# Altium schematic sheet MCU & Power.SchDoc
size A4; SheetNumber: 5; SheetTotal: 5
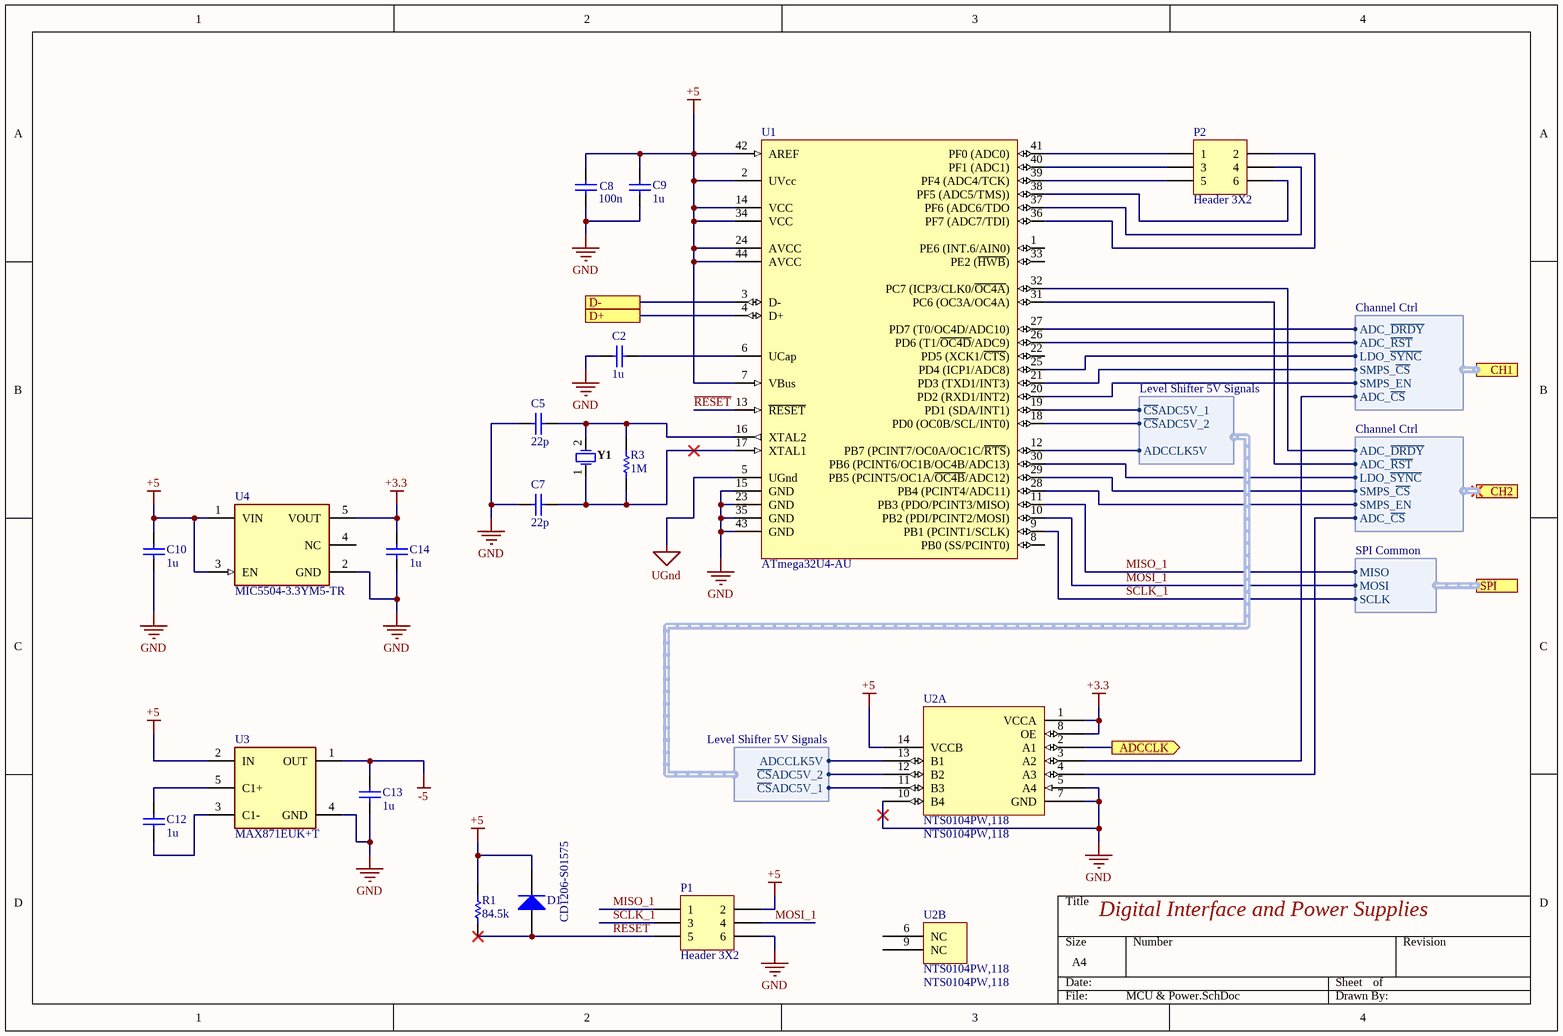
[diagram p0: MCU & Power.SchDoc]

## Parts
C2  1u  [CAPC2013X140X50LL20T25]
C5  22p  [CAPC2013X140X50NL20T25]
C7  22p  [CAPC2013X140X50NL20T25]
C8  100n  [CAPC2013X145X50LL20T25]
C9  1u  [CAPC2013X140X50LL20T25]
C10  1u  [CAPC2013X140X50LL20T25]
C12  1u  [CAPC2013X140X50LL20T25]
C13  1u  [CAPC2013X140X50LL20T25]
C14  1u  [CAPC2013X140X50LL20T25]
D1  CD1206-S01575  [BOUR-CD1206-S01575-2_N]
P1  Header 3X2  [HDR2X3]
P2  Header 3X2  [HDR2X3]
R1  84.5k  [RESC2013X60X35NL10T20]
R3  1M  [RESC2013X70X40NL20T20]
U1  ATmega32U4-AU  [44ML_M]
U2  NTS0104PW,118  [TSOP65P640X110-14N]  (parts A,B of 2)
U3  MAX871EUK+T  [FP-U5-2-MFG]
U4  MIC5504-3.3YM5-TR  [FP-SOT23-5LD-PL-1-MFG]
Y1  FOXSLF/160-20  [FOX-FOXSLF160-20]  (value not drawn)

## Ports
ADCCLK (out), CH1 (harness Channel Ctrl), CH2 (harness Channel Ctrl), D+, D-, SPI (harness SPI Common)

## Harnesses
Level Shifter 5V Signals: ~{CS}ADC5V_1, ~{CS}ADC5V_2, ADCCLK5V
Level Shifter 5V Signals: ADCCLK5V, ~{CS}ADC5V_1, ~{CS}ADC5V_2
Channel Ctrl: ADC_~{CS}, SMPS_EN, SMPS_~{CS}, LDO_~{SYNC}, ADC_~{RST}, ADC_~{DRDY}
SPI Common: MISO, MOSI, SCLK

## Nets
+3.3: C14.2 U2.1(VCCA) U2.8(OE) U4.5(VOUT)
+5: C8.2 C9.2 C10.2 D1.2(K) P1.2 R1.2 U1.2(UVcc) U1.7(VBus) U1.14(VCC) U1.24(AVCC) U1.34(VCC) U1.42(AREF) U1.44(AVCC) U2.14(VCCB) U3.2(IN) U4.1(VIN) U4.3(EN)
-5: C13.2 U3.1(OUT)
GND: C2.2 C5.1 C7.1 C8.1 C9.1 C10.1 C13.1 C14.1 P1.6 U1.15(GND) U1.23(GND) U1.35(GND) U1.43(GND) U2.5(A4) U2.7(GND) U2.10(B4) U3.4(GND) U4.2(GND)
UGnd: U1.5(UGnd)
ADCCLK: U2.2(A1) ; port ADCCLK
D+: U1.4(D+) ; port D+
D-: U1.3(D-) ; port D-
MISO_1: P1.1 U1.11(PB3_(PDO/PCINT3/MISO)) ; port SPI.MISO
MOSI_1: P1.4 U1.10(PB2_(PDI/PCINT2/MOSI)) ; port SPI.MOSI
~{RESET}: D1.1(A) P1.5 R1.1 U1.13(~{RESET})
SCLK_1: P1.3 U1.9(PB1_(PCINT1/SCLK)) ; port SPI.SCLK
NetC2_1: C2.1 U1.6(UCap)
NetC5_2: C5.2 R3.2 U1.16(XTAL2) Y1.2
NetC7_2: C7.2 R3.1 U1.17(XTAL1) Y1.1
NetC12_1: C12.1 U3.3(C1-)
NetC12_2: C12.2 U3.5(C1+)
NetP2_1: P2.1 U1.41(PF0_(ADC0))
NetP2_2: P2.2 U1.36(PF7_(ADC7/TDI))
NetP2_3: P2.3 U1.40(PF1_(ADC1))
NetP2_4: P2.4 U1.37(PF6_(ADC6/TDO)
NetP2_5: P2.5 U1.39(PF4_(ADC4/TCK))
NetP2_6: P2.6 U1.38(PF5_(ADC5/TMS)))
NetU1_12: U1.12(PB7_(PCINT7/OC0A/OC1C/~{RTS})) U2.13(B1) ; harness Level Shifter 5V Signals.ADCCLK5V
NetU1_18: U1.18(PD0_(OC0B/SCL/INT0)) U2.12(B2) ; harness Level Shifter 5V Signals.~{CS}ADC5V_2
NetU1_19: U1.19(PD1_(SDA/INT1)) U2.11(B3) ; harness Level Shifter 5V Signals.~{CS}ADC5V_1
NetU1_20: U1.20(PD2_(RXD1/INT2)) ; port CH1.SMPS_EN
NetU1_21: U1.21(PD3_(TXD1/INT3)) ; port CH1.SMPS_~{CS}
NetU1_25: U1.25(PD4_(ICP1/ADC8)) ; port CH1.LDO_~{SYNC}
NetU1_26: U1.26(PD6_(T1/~{OC4D}/ADC9)) ; port CH1.ADC_~{RST}
NetU1_27: U1.27(PD7_(T0/OC4D/ADC10)) ; port CH1.ADC_~{DRDY}
NetU1_28: U1.28(PB4_(PCINT4/ADC11)) ; port CH2.SMPS_EN
NetU1_29: U1.29(PB5_(PCINT5/OC1A/~{OC4B}/ADC12)) ; port CH2.SMPS_~{CS}
NetU1_30: U1.30(PB6_(PCINT6/OC1B/OC4B/ADC13)) ; port CH2.LDO_~{SYNC}
NetU1_31: U1.31(PC6_(OC3A/OC4A)) ; port CH2.ADC_~{RST}
NetU1_32: U1.32(PC7_(ICP3/CLK0/~{OC4A})) ; port CH2.ADC_~{DRDY}
NetU2_3: U2.3(A2) ; port CH1.ADC_~{CS}
NetU2_4: U2.4(A3) ; port CH2.ADC_~{CS}

Not connected (* = marked no-connect by the designer): U1 1(PE6_(INT.6/AIN0)) 8(PB0_(SS/PCINT0)) 22(PD5_(XCK1/~{CTS})) 33(PE2_(~{HWB})); U2 6(NC) 9(NC); U4 4(NC)

## Notes on the sheet
- Digital Interface and Power Supplies

## Library data of the parts
C2 C9 C10 C12-C14 = CMP-2007-03234-1: Part Number: C0805C105K3RACTU; Manufacturer: Kemet
C5 C7 = CMP-2007-04539-1: Part Number: 08051A220JAT2A; Manufacturer: AVX Interconnect / Elco
C8 = CMP-2007-01136-1: Manufacturer: Kemet; Part Number: C0805C104K3RALTU
D1 = CMP-0583-00001-2: 75 V Small Signal Switching Diode, 150 mA, 2.5 uA, 1026 Molded Package, RoHS, Tape and Reel; Manufacturer: Bourns; Reverse Voltage: 75 V; Average Forward Current: 150 mA; Reverse Current (Max.): 2.5 uA; Capacitance Between Terminals (Max.): 3 pF; Reverse Recovery Time (Max.): 4 nS; Forward Voltage (Max.): 1.00 V; Packing: Tape and Reel; Mounting Technology: Surface Mount; DatasheetVersion: Rev. 06/11; ComponentLink2URL: http://www.bourns.com/data/global/pdfs/CD1206_S01575.pdf; PackageReference: CD1206-S01575-2; RoHS: TRUE; ComponentLink1URL: http://www.bourns.com/; ComponentLink1Description: Manufacturer URL; ComponentLink3Description: Package Specification; ComponentLink3URL: http://www.bourns.com/data/global/pdfs/CD1206_S01575.pdf; ComponentLink2Description: Datasheet; PackageDescription: 2-Pin SMD, Body 3.2 x 1.5 mm; PartNumber: CD1206-S01575
P1 P2 = Header 3X2: Header, 3-Pin, Dual row; LatestRevisionDate: 17-Jul-2002; LatestRevisionNote: Re-released for DXP Platform.; Publisher: Altium Limited
R1 = CMP-2001-01285-1: Manufacturer: Yageo; Part Number: RC0805FR-0784K5L
R3 = CMP-2001-00339-1: Part Number: ERJ-6GEYJ105V; Manufacturer: Panasonic
U1 = CMP-0095-00285-2: 8-bit AVR Microcontroller, 2.7-5.5V, 16MHz, 32KB Flash, 1KB EEPROM, 2.5KB SRAM, USB Controller, 44-pin TQFP, Industrial Grade (-40°C to 85°C), Ext Osc; RevisionNote: DatasheetVersion updated. URLs added.; ComponentLink1Description: Manufacturer URL; PackageDescription: 44-Pin Plastic Thin Quad Flat Pack, 10 x 10 x 1.0 mm Body, 0.8 mm Pitch (TQFP); DatasheetVersion: revF, Nov-2010; ComponentLink2URL: http://www.atmel.com/dyn/resources/prod_documents/doc7766.pdf; ComponentLink1URL: http://www.atmel.com/; PackageReference: 44ML; ComponentLink2Description: ATmega16U4/32U4 Datasheet; PackageVersion: rev.G, Jul-2007; ComponentLink3URL: http://www.atmel.com/dyn/resources/prod_documents/7766S.pdf; ComponentLink3Description: ATmega16U4 ATmega32U4 Summary
U2 = NTS0104PW,118: Voltage Level Translator 14-Pin TSSOP T/R; Manufacturer: NXP Semiconductors; Max Supply Voltage: 5.5V; Min Supply Voltage: 1.65V; High Level Output Current: -20uA; Low Level Output Current: 1mA; Quiescent Current: 45uA; Propagation Delay: 280ns; Data Rate: 50Mbps; Number of Channels: 4; Max Power Dissipation: 250mW; Turn-On Delay Time: 5.8ns; Number of Elements: 1; Polarity: Non-Inverting; Operating Frequency-Max: 10MHz; Supplier 1: Digi-Key; RoHS: Yes; Category: Voltage Level Shifters; Stock 1: 15992; Pricing 1: 1=0.89000, 10=0.79100, 25=0.75120, 100=0.72820 (USD); Mount: Surface Mount; Case/Package: TSSOP; Number of Pins: 14; Min Operating Temperature: -40°C; Max Operating Temperature: 125°C; Logic Function: Translator; Packaging: Tape and Reel; Package Quantity: 1; Number of Bits: 4; Output Type: Voltage; Series: -; Radiation Hardening: No; RoHS Compliant: Yes; Lead Free: Lead Free; ComponentLink1URL: https://datasheet.ciiva.com/15096/getdatasheetpartid-507519-15096327.pdf?src-supplier=Verical; ComponentLink1Description: https://datasheet.ciiva.com/15096/getdatasheetpartid-507519-15096327.pdf?src-supplier=Verical; ComponentLink2URL: https://datasheet.ciiva.com/1899/nts0104-1899064.pdf?src-supplier=Digi-Key; ComponentLink2Description: https://datasheet.ciiva.com/1899/nts0104-1899064.pdf?src-supplier=Digi-Key; ComponentLink3URL: https://datasheet.ciiva.com/1899/nts0104-1899065.pdf?src-supplier=Digi-Key; ComponentLink3Description: https://datasheet.ciiva.com/1899/nts0104-1899065.pdf?src-supplier=Digi-Key; ComponentLink4URL: https://datasheet.ciiva.com/1899/nts0104-1899066.pdf?src-supplier=Digi-Key; ComponentLink4Description: https://datasheet.ciiva.com/1899/nts0104-1899066.pdf?src-supplier=Digi-Key; ComponentLink5URL: https://datasheet.ciiva.com/8244/nts0104-8244175.pdf?src-supplier=Avnet; ComponentLink5Description: https://datasheet.ciiva.com/8244/nts0104-8244175.pdf?src-supplier=Avnet; Manufacturer Part Number: NTS0104PW,118
U3 = CMP-05722-000155-1: IC REG CHRG PUMP LCD 1OUT SOT23; Manufacturer: Maxim; Nominal Supply Current: 2.7mA; Number Of Outputs: 1; Min Supply Voltage: 1V; Switching Frequency: 500kHz; Max Supply Voltage: 5.5V; Max Power Dissipation: 571mW; Switching Topology: Charge Pump; Output Type: Fixed; Negative Voltage Available: true; Standoff Height: 0mm; Output Voltage: -5.5V; Output Current: 25mA; Temperature: -40°C to +85°C; Lead Free: Yes; Footprint Url: https://pdfserv.maximintegrated.com/land_patterns/90-0174.PDF; Digikey Description: IC REG CHRG PUMP LCD 1OUT SOT23; Octopart: https://octopart.com/max871euk%2Bt-maxim+integrated-39868455; Device Class L1: Integrated Circuits (ICs); Automotive: No; ComponentLink2Description: Datasheet; Device Class L2: Power Management ICs; Category: IC; Temperature Range Low: -40°C; RoHS: TRUE; ComponentLink2URL: https://datasheets.maximintegrated.com/en/ds/MAX870-MAX871.pdf; Temperature Range High: +85°C; Height: 1.45mm; Package: U5-2; Device Class L3: Voltage Regulators - Switching; Manufacturer Part Number: MAX871EUK+T
U4 = CMP-2000-07604-2: IC REG LINEAR 3.3V 300MA SOT23-5; Quiescent Current: 38uA; Operating Supply Current: 42uA; Max Input Voltage: 5.5V; Min Input Voltage: 2.5V; Output Type: Fixed; Power Supply Rejection Ratio (PSRR): 60dB; Dropout Voltage: 380mV; Accuracy: 3%; Number of Outputs: 1; Nominal Output Voltage: 3.3V; Max Output Current: 300mA; Length: 2.9mm; Mount: Surface Mount; Width: 1.6mm; Packaging: Tape and Reel; Output Current: 300mA; Min Operating Temperature: -40°C; Max Operating Temperature: 125°C; Height: 1.1mm; Case/Package: SOT-23-5; REACH SVHC: No SVHC; Number of Pins: 5; Output Voltage: 3.3V
Y1 = CMP-1749-00003-1: Resistance Weld Thru-Hole Crystal, 16 MHz, -20 to 70 degC, 2-Pin THD, RoHS, Bulk; Voltage Rating: 250 V; Tolerance: 1%; Resistance: 221 kohm; Case\Package: Axial; Power Rating: 250 mW; RoHSCompliant: true; Package Quantity: 200; Packaging: Bulk; Min Operating Temperature: -55 degC; DatasheetVersion: Mar-15; ComponentLink1URL: http://www.foxonline.com/; Max Operating Temperature: 155 degC; PackageReference: FOXSLF160-20; Mount: Through Hole; PackageDescription: 2-Pin Through Hole Device, Body 11.35 x 4.65 mm; ComponentLink1Description: Manufacturer URL; ComponentLink2URL: http://www.foxonline.com/pdfs/hc49slf.pdf; ComponentLink2Description: Datasheet; Length: 0.248 inch